# EAGLE design integrated_bldc_dev (EAGLE 6.6.0)
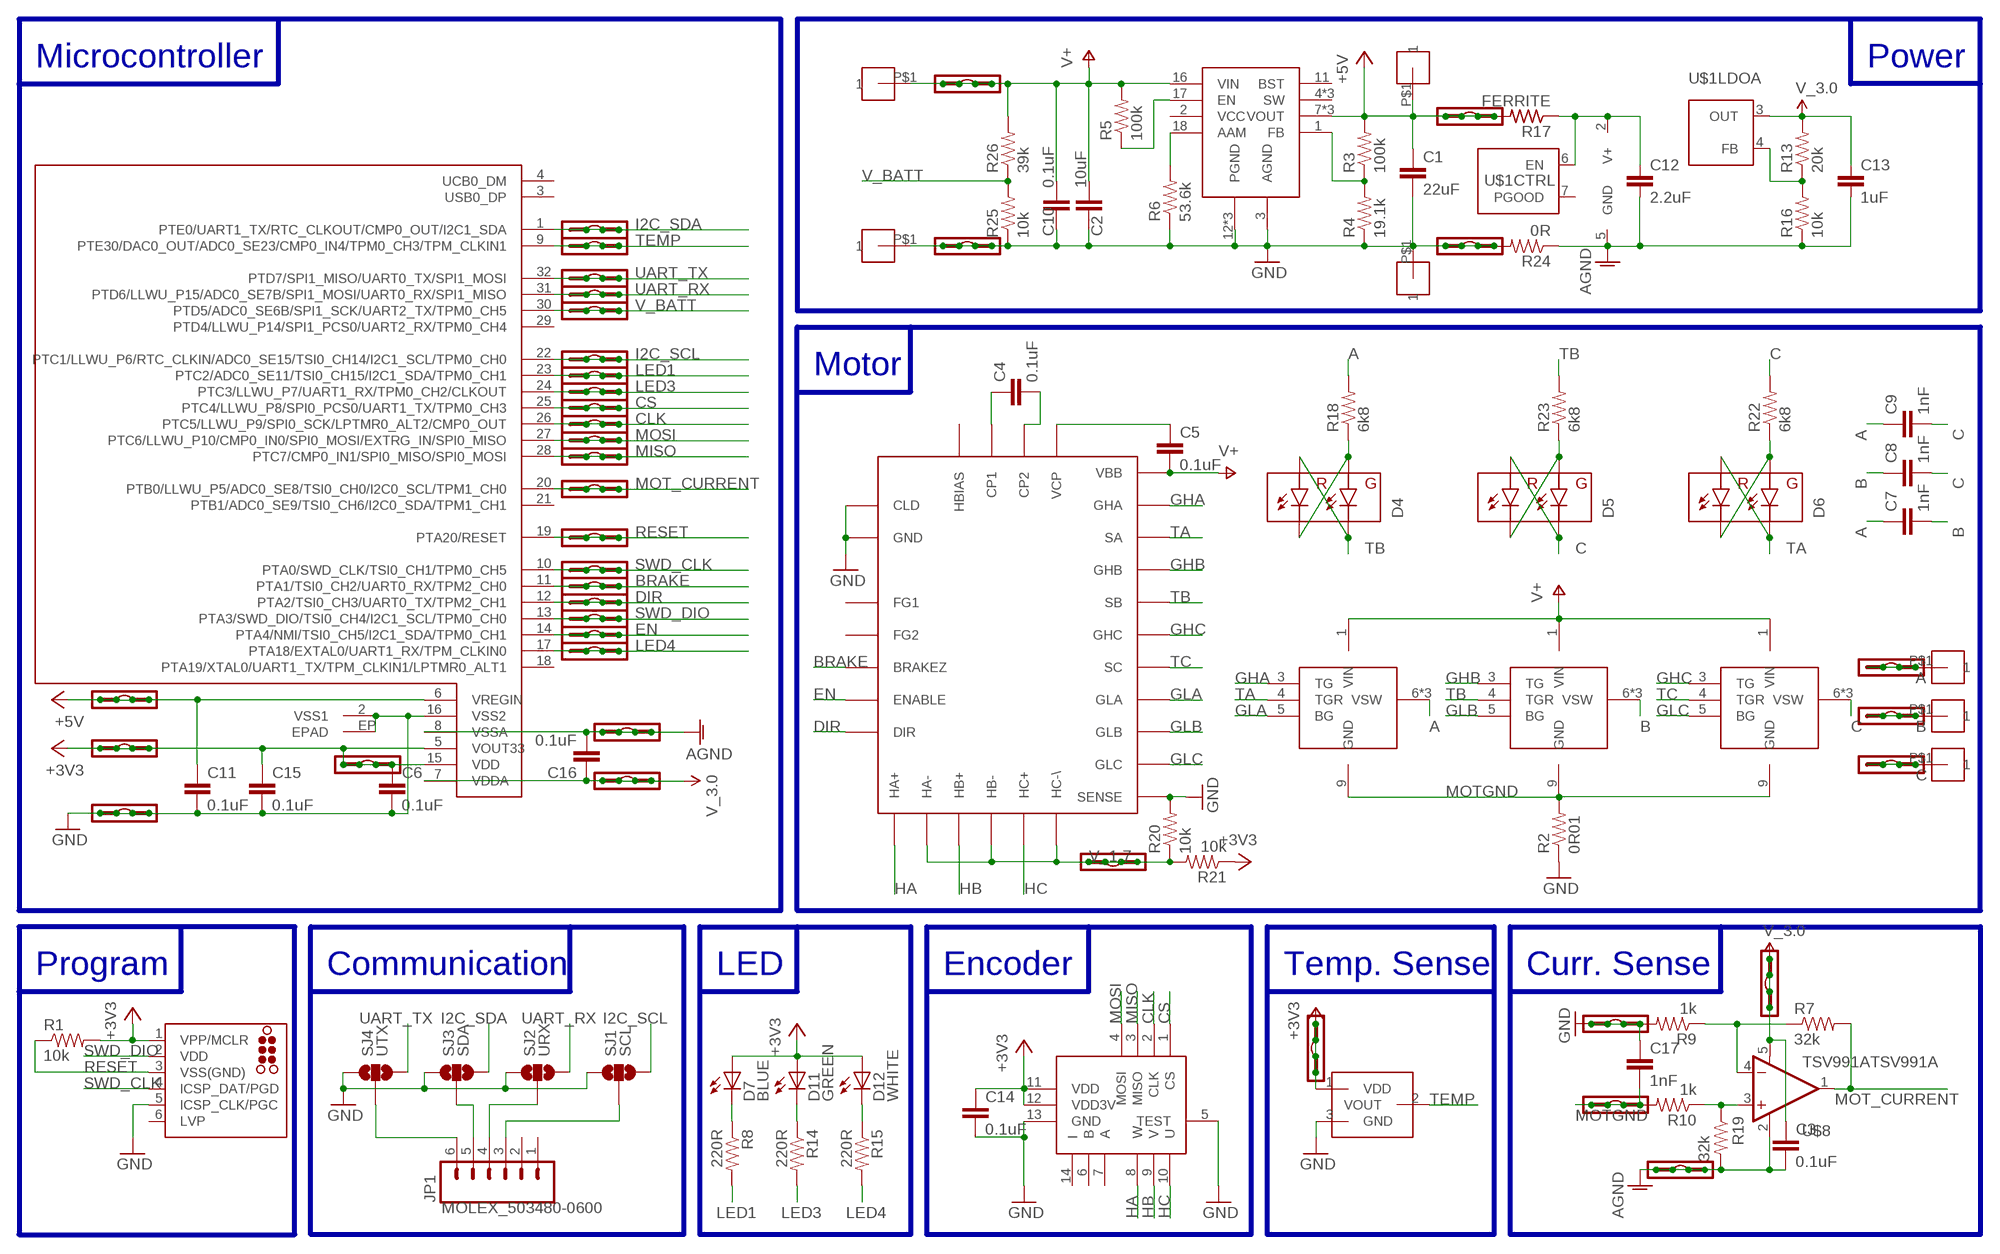
[diagram p0: schematic, sheet 1]

## Parts
3V3  M04LOCK  [1X04_LOCK]
A  M04LOCK  [1X04_LOCK]
AGND  M04LOCK  [1X04_LOCK]
AS5047P  AS5047P  [TSSOP14]
B  M04LOCK  [1X04_LOCK]
BRAKE  M04LOCK  [1X04_LOCK]
C  M04LOCK  [1X04_LOCK]
C1  22uF  CAP1210  [1210]
C2  10uF  CAP1206  [1206]
C3  0.1uF  CAP0402-CAP  [0402-CAP]
C4  0.1uF  CAP0402-CAP  [0402-CAP]
C5  0.1uF  CAP0402-CAP  [0402-CAP]
C6  0.1uF  CAP0402-CAP  [0402-CAP]
C7  1nF  CAP0603-CAP  [0603-CAP]
C8  1nF  CAP0603-CAP  [0603-CAP]
C9  1nF  CAP0603-CAP  [0603-CAP]
C10  0.1uF  CAP0603-CAP  [0603-CAP]
C11  0.1uF  CAP0402-CAP  [0402-CAP]
C12  2.2uF  CAP0402-CAP  [0402-CAP]
C13  1uF  CAP0402-CAP  [0402-CAP]
C14  0.1uF  CAP0402-CAP  [0402-CAP]
C15  0.1uF  CAP0402-CAP  [0402-CAP]
C16  0.1uF  CAP0402-CAP  [0402-CAP]
C17  1nF  CAP0402-CAP  [0402-CAP]
CLK  M04LOCK  [1X04_LOCK]
CS  M04LOCK  [1X04_LOCK]
D4  LED-RGLTST-C195KGJRKT  [LTST-C195KGJRKT]
D5  LED-RGLTST-C195KGJRKT  [LTST-C195KGJRKT]
D6  LED-RGLTST-C195KGJRKT  [LTST-C195KGJRKT]
D7  BLUE  LED-BLUE0603  [LED-0603]
D11  GREEN  LED-GREEN0603  [LED-0603]
D12  WHITE  LED-GREEN0603  [LED-0603]
DIR  M04LOCK  [1X04_LOCK]
EN  M04LOCK  [1X04_LOCK]
J2  PRG  TC2030-MCP-NL  [TC2030-MCP-NL]
JP1  MOLEX_503480-0600  [MOLEX_503480-0600]
LED1  M04LOCK  [1X04_LOCK]
LED3  M04LOCK  [1X04_LOCK]
LED4  M04LOCK  [1X04_LOCK]
MISO  M04LOCK  [1X04_LOCK]
MOSI  M04LOCK  [1X04_LOCK]
MOTCUR  M04LOCK  [1X04_LOCK]
MOTHI  M04LOCK  [1X04_LOCK]
MOTLO  M04LOCK  [1X04_LOCK]
PCLK  M04LOCK  [1X04_LOCK]
PDIO  M04LOCK  [1X04_LOCK]
R1  10k  RESISTOR0402-RES  [0402-RES]
R2  0R01  RESISTOR1206  [1206]
R3  100k  RESISTOR0402-RES  [0402-RES]
R4  19.1k  RESISTOR0402-RES  [0402-RES]
R5  100k  RESISTOR0402-RES  [0402-RES]
R6  53.6k  RESISTOR0402-RES  [0402-RES]
R7  32k  RESISTOR0402-RES  [0402-RES]
R8  220R  RESISTOR0402-RES  [0402-RES]
R9  1k  RESISTOR0402-RES  [0402-RES]
R10  1k  RESISTOR0402-RES  [0402-RES]
R13  20k  RESISTOR0402-RES  [0402-RES]
R14  220R  RESISTOR0402-RES  [0402-RES]
R15  220R  RESISTOR0402-RES  [0402-RES]
R16  10k  RESISTOR0402-RES  [0402-RES]
R17  FERRITE  R-US_R0603  [R0603]
R18  6k8  RESISTOR0402-RES  [0402-RES]
R19  32k  RESISTOR0402-RES  [0402-RES]
R20  10k  RESISTOR0402-RES  [0402-RES]
R21  10k  RESISTOR0402-RES  [0402-RES]
R22  6k8  RESISTOR0402-RES  [0402-RES]
R23  6k8  RESISTOR0402-RES  [0402-RES]
R24  0R  RESISTOR0402-RES  [0402-RES]
R25  10k  RESISTOR0402-RES  [0402-RES]
R26  39k  RESISTOR0402-RES  [0402-RES]
RESET  M04LOCK  [1X04_LOCK]
RX  M04LOCK  [1X04_LOCK]
SCL  M04LOCK  [1X04_LOCK]
SDA  M04LOCK  [1X04_LOCK]
SJ1  SCL  SOLDERJUMPER_2WAY  [SJ_TINY]
SJ2  URX  SOLDERJUMPER_2WAY  [SJ_TINY]
SJ3  SDA  SOLDERJUMPER_2WAY  [SJ_TINY]
SJ4  UTX  SOLDERJUMPER_2WAY  [SJ_TINY]
TEMP  M04LOCK  [1X04_LOCK]
TX  M04LOCK  [1X04_LOCK]
U$1  SC560C  [MLPQ-UT8]
U$2  A4931SMT  [28-CONTACT-QFN-ET]
U$3  MKL25Z128VFM4  [QFN-32]
U$4  MOSFET-HALFBRIDGECSD87333Q3D  [SON8]
U$5  MOSFET-HALFBRIDGECSD87333Q3D  [SON8]
U$6  MOSFET-HALFBRIDGECSD87333Q3D  [SON8]
U$7  MPM3610MPM3610GQV  [QFN20]
U$8  TSV991ATSV991A  [SOT23-5]
U$9  SOT_TEMP_SENSE  [SOT23-3]
U$10  A  PADMOT  [SMD_MOT_PAD]
U$11  B  PADMOT  [SMD_MOT_PAD]
U$12  C  PADMOT  [SMD_MOT_PAD]
V1.7  M04LOCK  [1X04_LOCK]
V3.0  M04LOCK  [1X04_LOCK]
V+  M04LOCK  [1X04_LOCK]
V-  M04LOCK  [1X04_LOCK]
V_BATT  M04LOCK  [1X04_LOCK]
VA+  M04LOCK  [1X04_LOCK]
VA-  M04LOCK  [1X04_LOCK]
VDD  M04LOCK  [1X04_LOCK]
VDDA  M04LOCK  [1X04_LOCK]
VIN+  V+  PAD  [SMD_BAT_PAD]
VIN-  GND  PAD  [SMD_BAT_PAD]
VOUT33  M04LOCK  [1X04_LOCK]
VOUT+  A  PADMOT  [SMD_MOT_PAD]
VOUT-  A  PADMOT  [SMD_MOT_PAD]
VREGIN  M04LOCK  [1X04_LOCK]
VSS  M04LOCK  [1X04_LOCK]
VSSA  M04LOCK  [1X04_LOCK]

## Nets
+3V3: 3V3.1 3V3.2 3V3.3 3V3.4 AS5047P.11(VDD) AS5047P.12(VDD3V) C6.1 C14.1 C15.1 D7.A D11.A D12.A J2.1(VPP/MCLR) R1.2 R21.1 U$3.5(VOUT33) U$3.15(VDD) U$9.1(VDD) VDD.1 VDD.2 VDD.3 VDD.4 VOUT33.1 VOUT33.2 VOUT33.3 VOUT33.4
+5V: C1.1 C11.1 R3.2 R17.2 U$3.6(VREGIN) U$7.7(VOUT) U$7.8(VOUT) U$7.9(VOUT) VA+.1 VA+.2 VA+.3 VA+.4 VOUT+.P$1 VREGIN.1 VREGIN.2 VREGIN.3 VREGIN.4
A: A.1 A.2 A.3 A.4 C7.1 C9.1 R18.2 U$5.6(VSW) U$5.7(VSW) U$5.8(VSW) U$10.P$1
AGND: AGND.1 AGND.2 AGND.3 AGND.4 C3.2 C12.2 C13.2 C16.2 R16.1 R19.2 R24.1 U$1.5(GND) U$3.8(VSSA) U$8.2(V-) VSSA.1 VSSA.2 VSSA.3 VSSA.4
B: B.1 B.2 B.3 B.4 C7.2 C8.1 U$4.6(VSW) U$4.7(VSW) U$4.8(VSW) U$11.P$1
BEN: R5.1 U$7.17(EN)
BRAKE: BRAKE.1 BRAKE.2 BRAKE.3 BRAKE.4 U$2.28(BRAKEZ) U$3.11(PTA1/TSI0_CH2/UART0_RX/TPM2_CH0)
C: C8.2 C9.2 C.1 C.2 C.3 C.4 D5.P$2(RA) D5.P$3(GC) R22.2 U$6.6(VSW) U$6.7(VSW) U$6.8(VSW) U$12.P$1
CLK: AS5047P.2(CLK) CLK.1 CLK.2 CLK.3 CLK.4 U$3.26(PTC5/LLWU_P9/SPI0_SCK/LPTMR0_ALT2/CMP0_OUT)
CS: AS5047P.1(CS) CS.1 CS.2 CS.3 CS.4 U$3.25(PTC4/LLWU_P8/SPI0_PCS0/UART1_TX/TPM0_CH3)
DIR: DIR.1 DIR.2 DIR.3 DIR.4 U$2.26(DIR) U$3.12(PTA2/TSI0_CH3/UART0_TX/TPM2_CH1)
EN: EN.1 EN.2 EN.3 EN.4 U$2.27(ENABLE) U$3.14(PTA4/NMI/TSI0_CH5/I2C1_SDA/TPM0_CH1)
FB: R3.1 R4.2 U$7.1(FB)
GHA: U$2.21(GHA) U$5.3(TG)
GHB: U$2.19(GHB) U$4.3(TG)
GHC: U$2.17(GHC) U$6.3(TG)
GLA: U$2.16(GLA) U$5.5(BG)
GLB: U$2.15(GLB) U$4.5(BG)
GLC: U$2.14(GLC) U$6.5(BG)
GND: AS5047P.5(TEST) AS5047P.13(GND) C1.2 C2.2 C6.2 C10.2 C11.2 C14.2 C15.2 C17.1 J2.5(ICSP_CLK/PGC) MOTLO.1 MOTLO.2 MOTLO.3 MOTLO.4 R2.1 R4.1 R6.1 R9.2 R20.2 R24.2 R25.1 SJ1.1 SJ2.1 SJ3.1 SJ4.1 U$2.7(GND) U$2.13(SENSE) U$2.25(CLD) U$3.2(VSS1) U$3.16(VSS2) U$3.EP(EPAD) U$7.3(AGND) U$7.12(PGND) U$7.13(PGND) U$7.14(PGND) U$9.3(GND) V-.1 V-.2 V-.3 V-.4 VA-.1 VA-.2 VA-.3 VA-.4 VIN-.P$1 VOUT-.P$1 VSS.1 VSS.2 VSS.3 VSS.4
HA: AS5047P.8(W) U$2.1(HA+)
HB: AS5047P.9(V) U$2.3(HB+)
HC: AS5047P.10(U) U$2.5(HC+)
I2C_SCL: SCL.1 SCL.2 SCL.3 SCL.4 SJ1.3 U$3.22(PTC1/LLWU_P6/RTC_CLKIN/ADC0_SE15/TSI0_CH14/I2C1_SCL/TPM0_CH0)
I2C_SDA: SDA.1 SDA.2 SDA.3 SDA.4 SJ3.3 U$3.1(PTE0/UART1_TX/RTC_CLKOUT/CMP0_OUT/I2C1_SDA)
LED1: LED1.1 LED1.2 LED1.3 LED1.4 R8.2 U$3.23(PTC2/ADC0_SE11/TSI0_CH15/I2C1_SDA/TPM0_CH1)
LED3: LED3.1 LED3.2 LED3.3 LED3.4 R14.2 U$3.24(PTC3/LLWU_P7/UART1_RX/TPM0_CH2/CLKOUT)
LED4: LED4.1 LED4.2 LED4.3 LED4.4 R15.2 U$3.17(PTA18/EXTAL0/UART1_RX/TPM_CLKIN0)
MISO: AS5047P.3(MISO) MISO.1 MISO.2 MISO.3 MISO.4 U$3.28(PTC7/CMP0_IN1/SPI0_MISO/SPI0_MOSI)
MOSI: AS5047P.4(MOSI) MOSI.1 MOSI.2 MOSI.3 MOSI.4 U$3.27(PTC6/LLWU_P10/CMP0_IN0/SPI0_MOSI/EXTRG_IN/SPI0_MISO)
MOT_CURRENT: MOTCUR.1 MOTCUR.2 MOTCUR.3 MOTCUR.4 R7.2 U$3.20(PTB0/LLWU_P5/ADC0_SE8/TSI0_CH0/I2C0_SCL/TPM1_CH0) U$8.1(OUT)
MOTGND: C17.2 MOTHI.1 MOTHI.2 MOTHI.3 MOTHI.4 R2.2 R10.2 U$4.9(GND) U$5.9(GND) U$6.9(GND)
N$1: R7.1 R9.1 U$8.4(-IN)
N$2: R10.1 R19.1 U$8.3(+IN)
N$3: D4.P$1(GA) D4.P$4(RC) R18.1
N$4: D7.C R8.1
N$5: R6.2 U$7.18(AAM)
N$10: D11.C R14.1
N$12: D12.C R15.1
N$13: R13.1 R16.2 U$1.4(LDOA:FB)
N$14: D5.P$1(GA) D5.P$4(RC) R23.1
N$15: C12.1 R17.1 U$1.2(V+) U$1.6(CTRL:EN)
N$16: D6.P$1(GA) D6.P$4(RC) R22.1
N$19: C5.1 U$2.12(VCP)
N$20: C4.1 U$2.9(CP1)
N$21: C4.2 U$2.10(CP2)
N$36: JP1.6 SJ4.2
N$37: JP1.5 SJ3.2
N$38: JP1.4 SJ2.2
N$39: JP1.3 SJ1.2
RESET: J2.3(VSS(GND)) R1.1 RESET.1 RESET.2 RESET.3 RESET.4 U$3.19(PTA20/RESET)
SWD_CLK: J2.4(ICSP_DAT/PGD) PCLK.1 PCLK.2 PCLK.3 PCLK.4 U$3.10(PTA0/SWD_CLK/TSI0_CH1/TPM0_CH5)
SWD_DIO: J2.2(VDD) PDIO.1 PDIO.2 PDIO.3 PDIO.4 U$3.13(PTA3/SWD_DIO/TSI0_CH4/I2C1_SCL/TPM0_CH0)
TA: D6.P$2(RA) D6.P$3(GC) U$2.22(SA) U$5.4(TGR)
TB: D4.P$2(RA) D4.P$3(GC) R23.2 U$2.20(SB) U$4.4(TGR)
TC: U$2.18(SC) U$6.4(TGR)
TEMP: TEMP.1 TEMP.2 TEMP.3 TEMP.4 U$3.9(PTE30/DAC0_OUT/ADC0_SE23/CMP0_IN4/TPM0_CH3/TPM_CLKIN1) U$9.2(VOUT)
UART_RX: RX.1 RX.2 RX.3 RX.4 SJ2.3 U$3.31(PTD6/LLWU_P15/ADC0_SE7B/SPI1_MOSI/UART0_RX/SPI1_MISO)
UART_TX: SJ4.3 TX.1 TX.2 TX.3 TX.4 U$3.32(PTD7/SPI1_MISO/UART0_TX/SPI1_MOSI)
V+: C2.1 C5.2 C10.1 R5.2 R26.2 U$2.11(VBB) U$4.1(VIN) U$5.1(VIN) U$6.1(VIN) U$7.16(VIN) V+.1 V+.2 V+.3 V+.4 VIN+.P$1
V_1.7: R20.1 R21.2 U$2.2(HA-) U$2.4(HB-) U$2.6(HC-\) V1.7.1 V1.7.2 V1.7.3 V1.7.4
V_3.0: C3.1 C13.1 C16.1 R13.2 U$1.3(LDOA:OUT) U$3.7(VDDA) U$8.5(V+) V3.0.1 V3.0.2 V3.0.3 V3.0.4 VDDA.1 VDDA.2 VDDA.3 VDDA.4
V_BATT: R25.2 R26.1 U$3.30(PTD5/ADC0_SE6B/SPI1_SCK/UART2_TX/TPM0_CH5) V_BATT.1 V_BATT.2 V_BATT.3 V_BATT.4
Unconnected: AS5047P.6(B) AS5047P.7(A) AS5047P.14(I) J2.6(LVP) JP1.1 JP1.2 U$1.1(LDOB:OUT) U$1.7(CTRL:PGOOD) U$1.8(LDOB:FB) U$2.8(HBIAS) U$2.23(FG1) U$2.24(FG2) U$3.3(USB0_DP) U$3.4(UCB0_DM) U$3.18(PTA19/XTAL0/UART1_TX/TPM_CLKIN1/LPTMR0_ALT1) U$3.21(PTB1/ADC0_SE9/TSI0_CH6/I2C0_SDA/TPM1_CH1) U$3.29(PTD4/LLWU_P14/SPI1_PCS0/UART2_RX/TPM0_CH4) U$7.2(VCC) U$7.4(SW) U$7.5(SW) U$7.6(SW) U$7.11(BST)

## Buses
B$1
B$2
B$3
B$4
B$5
B$6
B$7
B$8
B$9

## Notes on the sheet
- Microcontroller | Power
- Motor
- Program | Communication | LED | Encoder | Temp. Sense | Curr. Sense

## Library data of the parts
3V3 A AGND B BRAKE C CLK CS DIR EN LED1 LED3 LED4 MISO MOSI MOTCUR MOTHI MOTLO PCLK PDIO RESET RX SCL SDA TEMP TX V1.7 V3.0 V+ V- V_BATT VA+ VA- VDD VDDA VOUT33 VREGIN VSS VSSA = modular_robotics:M04: Header 4 Standard 4-pin 0.1" header. Use with straight break away headers (SKU : PRT-00116), right angle break away headers (PRT-00553), swiss pins (PRT-00743), machine pins (PRT-00117), and female headers (PRT-00115). Molex polarized connector foot print use with SKU : PRT-08231 with associated crimp pins and housings. 1MM SMD Version SKU: PRT-10208
AS5047P = dhaldane:AS5047P
C1-C11 C14-C17 = SparkFun-Passives:CAP: Capacitor Standard 0603 ceramic capacitor, and 0.1" leaded capacitor.
C12 = biomimetic:CAP: Capacitor Standard 0603 ceramic capacitor, and 0.1" leaded capacitor.; VOLTAGE: 10V
C13 = biomimetic:CAP: Capacitor Standard 0603 ceramic capacitor, and 0.1" leaded capacitor.; VOLTAGE: 6.3V
D4-D6 = SparkFun-LED:LED-RG; PROD_ID: DIO-12140
D7 = SparkFun-LED:LED-BLUE: Blue LEDs for production use Various blue LEDs stocked by SparkFun production 0603 - DIO-08575 Rebel - DIO-09553 1206 - DIO-09911; PROD_ID: DIO-08575
D11 = SparkFun-LED:LED-GREEN: Various green LEDs 0603- DIO-00821 LARGE- DIO-00862 LILYPAD- DIO-09910; PROD_ID: DIO-00821
D12 = SparkFun-LED:LED-GREEN: Various green LEDs 0603- DIO-00821 LARGE- DIO-00862 LILYPAD- DIO-09910; PROD_ID: DIO-00821; VALUE: GREEN
J2 = tag-connect:TC2030: TAG-CONNECT ICSP Connector Manufacturer: Tag-Connect <http://www.tag-connect.com> Cable for easy In-Circuit Serial Programming. Designed for Microchip ICD2, suitable for many others. Two variants - one "with legs" (for hands-free fit on PCB) and another "without legs" for quick programming. PAD Description 1 MCLR/Vpp 2 Vdd 3 GND 4 PGD (ISPDAT) 5 PGC (ISPCLK) 6 nc (used for LVP) ©2009 ROFA.cz - modified and updated by Robert Darlington ‹rdarlington@gmail.com›
JP1 = biomimetic:MOLEX_503480-0600: Molex FPC connector, 6 pos.; DIGIKEY: WM1387CT-ND
R1-R10 R14 R15 R18-R24 = SparkFun-Passives:RESISTOR: Resistor Basic schematic elements and footprints for 0603, 1206, and PTH resistors.
R13 R16 R25 R26 = biomimetic:RESISTOR: Resistor Basic schematic elements and footprints for 0603, 1206, and PTH resistors.
R17 = rcl:R-US_: RESISTOR, American symbol
SJ1-SJ4 = modular_robotics:SOLDERJUMPER_2WAY: Solder Jumper 2 way solder jumper
U$1 = modular_robotics:SC560C
U$2 = ee192:A4931
U$3 = dhaldane:MKL25Z128VFM4
U$4-U$6 = dhaldane:MOSFET-HALFBRIDGE
U$7 = dhaldane:MPM3610
U$8 = dhaldane:TSV991A
U$9 = dhaldane:SOT_TEMP_SENSE
U$10-U$12 VIN+ VIN- VOUT+ VOUT- = dhaldane:PAD

## Board
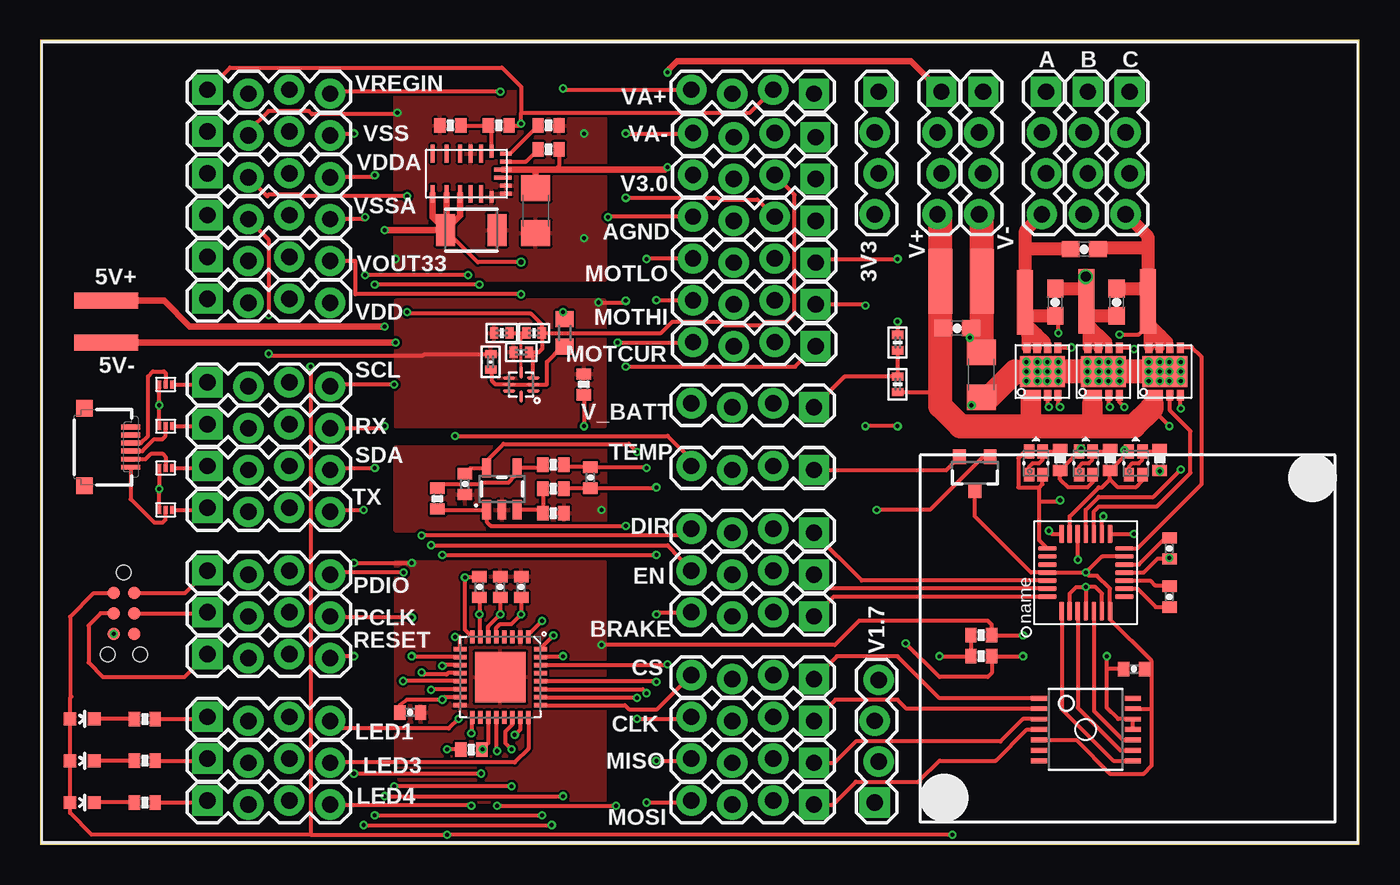
[diagram p1: board, top side]
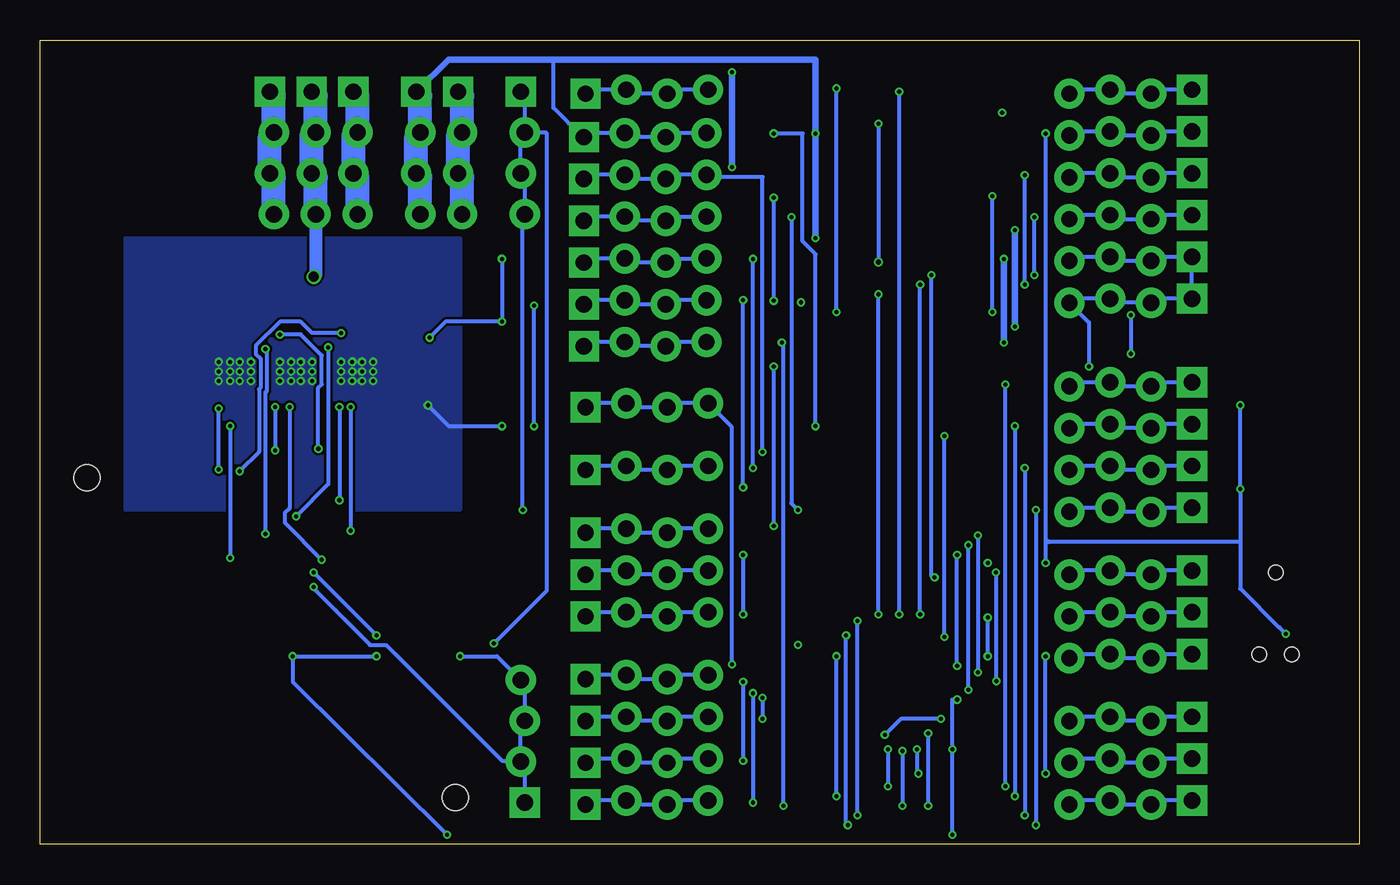
[diagram p2: board, bottom side, seen from below]

Size 82 x 50 mm. Coordinates in mm from the lower left corner, seen from the top.
Outline: 0,0 82,0 82,50 0,50 0,0
Copper layers (1*16): Top 0.035mm / dielectric 1.5mm / Bottom 0.035mm
Design rules "bay_area_circuits": minimum track width 5mil, minimum drill 10mil, track to track 5mil, track to pad 5mil, pad to pad 5mil, via to via 5mil, smd to smd 5mil, copper to edge 10mil, drill to drill 10mil, minimum pad ring 5mil, minimum via ring 5mil, stop-mask expansion 4mil, vias tented up to drill 5mil, thermal gap 6mil
Holes 1.6 mm at 56.2,2.9 79.1,22.8

### Footprints (pad centres in the part's own frame; a part is rotated, then mirrored left to right if it is on the bottom)
1X04_LOCK = drill 1.016 pad 1.88 square: 1 0,0.127 | drill 1.016 pad 1.88: 2 2.54,-0.127; 3 5.08,0.127; 4 7.62,-0.127
TSSOP14 = smd 0.991 x 0.305: 1 -2.918,4.49; 2 -2.918,3.84; 3 -2.918,3.19; 4 -2.918,2.54; 5 -2.918,1.89; 6 -2.918,1.24; 7 -2.918,0.59; 8 2.918,0.59; 9 2.918,1.24; 10 2.918,1.89; 11 2.918,2.54; 12 2.918,3.19; 13 2.918,3.84; 14 2.918,4.49
1210 = smd 1.2 x 2: 1 -1.6,0; 2 1.6,0
1206 = smd 1.6 x 1.8: 1 -1.4,0; 2 1.4,0
0402-CAP = smd 0.7 x 0.9: 1 -0.65,0; 2 0.65,0
0603-CAP = smd 1.1 x 1: 1 -0.85,0; 2 0.85,0
0402-CAP' = smd 0.508 x 0.711: 1 -0.483,0; 2 0.483,0
LTST-C195KGJRKT = smd 0.65 x 0.85: P$1 0.425,0.725; P$2 -0.425,0.725; P$3 0.425,-0.725; P$4 -0.425,-0.725
LED-0603 = smd 0.8 x 0.8: A 0,-0.75; C 0,0.75
TC2030-MCP-NL = smd 0.787 x 0.787: 1 1.27,-0.635; 2 1.27,0.635; 3 2.54,-0.635; 4 2.54,0.635; 5 3.81,-0.635; 6 3.81,0.635 | hole 0.889: 0,0; 5.08,-1.016; 5.08,1.016
MOLEX_503480-0600 = smd 0.3 x 1.15: 1 -1.25,1.725; 2 -0.75,1.725; 3 -0.25,1.725; 4 0.25,1.725; 5 0.75,1.725; 6 1.25,1.725 | smd 1.035 x 1: L -2.408,-1.15; R 2.408,-1.15
0402-RES = smd 0.7 x 0.9: 1 -0.65,0; 2 0.65,0
0402-RES' = smd 0.508 x 0.711: 1 -0.483,0; 2 0.483,0
R0603 = smd 1 x 1.1: 1 -0.85,0; 2 0.85,0
SJ_TINY = smd 0.5 x 0.25: 1 0,0.4; 2 0,0; 3 0,-0.4
MLPQ-UT8 = smd 0.8 x 0.2: 1 -0.75,0.4; 2 -0.75,0; 3 -0.75,-0.4; 5 0.75,-0.4; 6 0.75,0; 7 0.75,0.4 | smd 0.2 x 0.8: 4 0,-0.75; 8 0,0.75
28-CONTACT-QFN-ET = smd 1.15 x 0.3: 1 -2.4,1.5; 2 -2.4,1; 3 -2.4,0.5; 4 -2.4,0; 5 -2.4,-0.5; 6 -2.4,-1; 7 -2.4,-1.5; 15 2.4,-1.5; 16 2.4,-1; 17 2.4,-0.5; 18 2.4,0; 19 2.4,0.5; 20 2.4,1; 21 2.4,1.5 | smd 0.3 x 1.15: 8 -1.5,-2.4; 9 -1,-2.4; 10 -0.5,-2.4; 11 0,-2.4; 12 0.5,-2.4; 13 1,-2.4; 14 1.5,-2.4; 22 1.5,2.4; 23 1,2.4; 24 0.5,2.4; 25 0,2.4; 26 -0.5,2.4; 27 -1,2.4; 28 -1.5,2.4
QFN-32 = smd 0.285 x 0.8: 1 -1.75,-2.5; 2 -1.25,-2.5; 3 -0.75,-2.5; 4 -0.25,-2.5; 5 0.25,-2.5; 6 0.75,-2.5; 7 1.25,-2.5; 8 1.75,-2.5; 17 1.75,2.5; 18 1.25,2.5; 19 0.75,2.5; 20 0.25,2.5; 21 -0.25,2.5; 22 -0.75,2.5; 23 -1.25,2.5; 24 -1.75,2.5 | smd 0.8 x 0.285: 9 2.5,-1.75; 10 2.5,-1.25; 11 2.5,-0.75; 12 2.5,-0.25; 13 2.5,0.25; 14 2.5,0.75; 15 2.5,1.25; 16 2.5,1.75; 25 -2.5,1.75; 26 -2.5,1.25; 27 -2.5,0.75; 28 -2.5,0.25; 29 -2.5,-0.25; 30 -2.5,-0.75; 31 -2.5,-1.25; 32 -2.5,-1.75 | smd 3.15 x 3.15: EP 0,0
SON8 = smd 0.65 x 1.09: 1 1.475,-0.65 | smd 0.65 x 0.44: 3 1.475,0.325; 4 1.475,0.975; 5 -1.475,0.975; 6 -1.475,0.325; 7 -1.475,-0.325; 8 -1.475,-0.975 | smd 1.9 x 2.8: 9 0,0
QFN20 = smd 0.8 x 0.25: 1 -1.4,1.55 | smd 1.1 x 0.25: 2 -1.25,0.9; 3 -1.25,0.25; 4 -1.25,-0.4; 5 -1.25,-1.25; 6 -1.25,-2.1; 7 1.25,-2.1; 8 1.25,-1.25; 9 1.25,-0.4; 10 1.25,0.25; 11 1.25,0.9 | smd 0.7 x 0.25: 12 1.45,1.55 | smd 0.25 x 0.7: 13 1.25,2.45; 14 0.75,2.45; 17 -0.75,2.45; 18 -1.25,2.45 | smd 0.25 x 1.1: 15 0.25,2.25; 16 -0.25,2.25
SOT23-5 = smd 0.55 x 1.2: 1 -0.95,-1.3; 2 0,-1.3; 3 0.95,-1.3; 4 0.95,1.3; 5 -0.95,1.3
SOT23-3 = smd 0.8 x 0.9: 1 -0.95,-1; 2 0.95,-1; 3 0,1.1
SMD_MOT_PAD = smd 4 x 1: P$1 0.2,0
SMD_BAT_PAD = smd 4 x 1.5: P$1 0.1,0.05

### Placement (x,y rotation side)
3V3  52,46.8 270 top
A  62.4,46.8 270 top
AGND  48.2,38.9 180 top
AS5047P  65,4.6 0 top
B  65,46.8 270 top
BRAKE  48.1,14.3 180 top
C  67.6,46.8 270 top
C1  26.8,38.2 0 top
C2  30.8,39.4 270 top
C3  26.4,22.4 270 top
C4  70.2,15.4 90 top
C5  70.2,18.4 270 top
C6  23,8.2 0 top
C7  63.11,33.71 90 top
C8  66.92,33.71 90 top
C9  64.9,37 0 top
C10  57,32.1 0 top
C11  28.6,16 90 top
C12  2.2uF  [0402-CAP']  28,30 90 top
C13  1uF  [0402-CAP']  29.9,30.6 180 top
C14  68,10.9 0 top
C15  29.9,16 90 top
C16  27.3,16 90 top
C17  34.2,22.8 270 top
CLK  48.1,7.8 180 top
CS  48.1,10.4 180 top
D4  68.1,23.7 180 top
D5  65,23.7 180 top
D6  61.9,23.7 180 top
D7  2.6,7.8 270 top
D11  2.6,5.2 270 top
D12  2.6,2.6 270 top
DIR  48.1,19.5 180 top
EN  48.1,16.9 180 top
J2  5.2,16.9 270 top
JP1  3.9,24.7 270 top
LED1  10.4,7.8 0 top
LED3  10.4,5.2 0 top
LED4  10.4,2.6 0 top
MISO  48.1,5.2 180 top
MOSI  48.1,2.6 180 top
MOTCUR  48.2,31.1 180 top
MOTHI  48.2,33.7 180 top
MOTLO  48.2,36.3 180 top
PCLK  10.4,14.3 0 top
PDIO  10.4,16.9 0 top
R1  26.8,5.9 180 top
R2  58.5,29.2 270 top
R3  28.5,44.7 0 top
R4  25.5,44.7 0 top
R5  31.6,43.2 0 top
R6  31.6,44.7 180 top
R7  24.7,21.5 270 top
R8  6.5,7.8 0 top
R9  31.9,23.6 0 top
R10  31.9,22.1 0 top
R13  20k  [0402-RES']  30.7,31.8 0 top
R14  6.5,5.2 0 top
R15  6.5,2.6 0 top
R16  10k  [0402-RES']  28.7,31.8 0 top
R17  32.6,31.8 90 top
R18  69.6,23.9 270 top
R19  31.9,20.6 0 top
R20  58.5,13 0 top
R21  58.5,11.7 180 top
R22  63.4,23.9 270 top
R23  66.5,23.9 270 top
R24  33.8,28.6 270 top
R25  10k  [0402-RES']  53.3,31.2 270 top
R26  39k  [0402-RES']  53.3,28.6 270 top
RESET  10.4,11.7 0 top
RX  10.4,26 0 top
SCL  10.4,28.6 0 top
SDA  10.4,23.4 0 top
SJ1  7.8,28.6 90 top
SJ2  7.8,26 90 top
SJ3  7.8,23.4 90 top
SJ4  7.8,20.8 90 top
TEMP  48.1,23.4 180 top
TX  10.4,20.8 0 top
U$1  29.9,28.6 180 top
U$2  65,16.9 90 top
U$3  28.6,10.4 180 top
U$4  66.1,29.4 270 top
U$5  62.3,29.4 270 top
U$6  69.9,29.4 270 top
U$7  26.5,41.7 270 top
U$8  28.7,22.1 0 top
U$9  58.1,23.1 180 top
U$10  61.22,33.5 90 top
U$11  65.04,33.56 90 top
U$12  68.85,33.56 90 top
U$16  [INFO]  79.3,27.3 90 top
V1.7  52,2.6 90 top
V3.0  48.2,41.5 180 top
V+  55.9,46.8 270 top
V-  58.5,46.8 270 top
V_BATT  48.1,27.3 180 top
VA+  48.1,46.8 180 top
VA-  48.2,44.1 180 top
VDD  10.4,33.8 0 top
VDDA  10.4,41.6 0 top
VIN+  55.9,35.1 270 top
VIN-  58.5,35.1 270 top
VOUT33  10.4,36.4 0 top
VOUT+  3.9,33.8 0 top
VOUT-  3.9,31.2 0 top
VREGIN  10.4,46.8 0 top
VSS  10.4,44.2 0 top
VSSA  10.4,39 0 top

### Tracks (layer width: path | path; a pad name or v marks a point on that pad's centre or on a via)
+3V3  (via drill 0.25)
  Top 0.254: U$3.5 28.35,13.45 28.6,13.7 29.3,13.7 v29.9,14.3 C15.1 | J2.1 3.33,15.63 1.85,14.15 1.85,9.1 | R1.2 v25.3,5.9 | U$3.15 25.15,9.15 v25,9 22.8,9 22.35,8.65 C6.1 | 1.85,9.1 D7.A D11.A D12.A 1.85,1.95 3.2,0.6 16.8,0.6 | 1.85,9.1 1.95,9.2 | AS5047P.11 AS5047P.12 67.01,7.79 66.3,8.5 66.3,11 | 66.3,11 v66.3,11.7 | v56.7,0.6 v25.3,0.6 16.8,0.6 | U$9.1 58.6,24.1 55.3,20.8 v52,20.8 | v53.8,12.5 55.9,10.4 58.9,10.4 59.15,10.65 R21.1 v61.1,11.7 | v16.8,29.7 16.8,0.6 | v29.9,34.2 19.59,34.2 19.59,36.27 VOUT33.4 | C14.1 66.4,10.9 66.3,11
  Bottom 0.254: 12.69,33.93 VDD.2 | VDD.2 15.23,33.67 VDD.3 17.77,33.93 VDD.4 16.8,32.45 v16.8,29.7 | VOUT33.4 17.77,36.53 VOUT33.3 15.23,36.27 VOUT33.2 12.69,36.53 VOUT33.1 VDD.1 12.69,33.93 | 3V3.2 52.13,44.01 3V3.3 51.87,41.47 3V3.4 52,39.05 v52,20.8 | 3V3.2 51.87,46.55 3V3.1 | v56.7,0.6 66.3,10.1 v66.3,11.7 v61.1,11.7 | v25.3,0.6 v25.3,5.9 25.3,9 v25,9 | v53.8,12.5 50.5,15.8 50.5,44.2 50.56,44.26 3V3.2 | 12.69,33.93 arc-90 VDD.2 | v29.9,14.3 v29.9,34.2
+5V  (via drill 0.25, 0.3)
  Top 0.254: U$3.6 27.85,13.55 v28.6,14.3 C11.1 | v28.6,46.8 18.15,46.8 VREGIN.4 | R3.2 29.8,44.7 v29.9,44.8 29.9,45.5 | v29.9,36.2 27.2,36.2 C1.1 | 29.9,45.5 44.13,45.5 VA+.2 | v32.5,47 32.57,46.93 VA+.4 | R17.2 32.5,32.75 v32.5,33.1 | VREGIN.1 10.43,46.93 11.8,48.3 28.7,48.3 29.9,47.1 29.9,45.5
  Top 0.406: U$7.9 26.1,39.1 C1.1 | U$7.7 24.4,39 C1.1 | U$7.8 25.25,38.25 C1.1 | VOUT+.P$1 7.7,33.8 9.3,32.2 v21.4,32.2 | C1.1 v21.4,38.2
  Bottom 0.254: VA+.4 42.77,46.93 VA+.3 45.31,46.67 VA+.2 47.85,46.93 VA+.1 | VREGIN.4 17.77,46.93 VREGIN.3 15.23,46.67 VREGIN.2 12.69,46.93 VREGIN.1 | v29.9,44.8 v29.9,36.2 | v28.6,14.3 v28.6,46.8 | v32.5,33.1 v32.5,47
  Bottom 0.406: v21.4,32.2 v21.4,38.2
A  (via drill 0.25)
  Top 0.254: 61.22,33.56 U$10.P$1 | v63.3,31.8 63.3,32.67 C7.1 | R18.2 v69.6,23.2
  Top 0.406: 62.51,31.29 arc-90 62.61,31.19 U$5.6
  Top 0.61: 62.51,31.29 62,31.8 61.9,31.6 61.96,31.54 U$5.7 | U$5.8 61.31,32.19 61.25,32.25
  Top 0.813: U$10.P$1 61.26,33.8 61.26,37 | C7.1 61.49,32.86 61.22,32.6 | 61.26,37 61.26,38.16 A.4 | C9.1 61.26,37
  Top 1.016: 61.22,33.56 61.22,32.6 61.22,32.28 61.25,32.25 61.9,31.6
  Bottom 0.254: v63.3,31.8 65.1,31.8 65.8,32.5 67.1,32.5 68.6,31 68.6,30.5 68.3,30.2 68.3,28.4 68.4,28.3 68.4,24.4 v69.6,23.2
  Bottom 1.5: A.4 62.27,41.47 A.3 62.53,44.01 A.2 62.27,46.55 A.1
AGND  (via drill 0.25)
  Top 0.254: v34.7,33.7 36.3,33.7 v36.4,33.8 | AGND.2 44.59,40.1 42.2,40.1 42.1,40.2 v36.4,40.2 | U$3.8 26.4,13.35 v26.4,16.6 27.25,16.6 C16.2 | v26.6,35.4 v20.2,35.4 | v20.2,39 20.07,38.87 VSSA.4 | AGND.4 35.33,39.03 v35.3,39 | VSSA.2 14.2,37.61 v14.2,32.9 | v14.2,30.5 14.3,30.4 23.8,30.4 23.88,30.48 C12.2
  Bottom 0.254: AGND.1 47.95,39.03 AGND.2 45.41,38.77 AGND.3 42.87,39.03 AGND.4 | VSSA.1 12.69,39.13 VSSA.2 15.23,38.87 VSSA.3 17.77,39.13 VSSA.4 | v36.4,33.8 v36.4,40.2 | v26.4,16.6 26.6,16.7 v26.6,35.4 | v20.2,35.4 v20.2,39 | v35.3,39 35.3,21.2 v34.9,20.8 | v14.2,32.9 v14.2,30.5
  pour Top (isolate 0.15, rank 2): 22.1,24.7 35.1,24.7 35.1,19.5 22.1,19.5
  pour Top (isolate 0.15): 35.1,33.8 22.1,33.8 22.1,26 35.1,26
B  (via drill 0.6)
  Top 0.254: 65.1,33.82 65.1,34.4 64.94,34.56 64.94,35.24 v65,35.3
  Top 0.406: 66.32,31.28 66.42,31.18 U$4.6
  Top 0.61: 66.32,31.28 65.9,31.7 65.8,31.7 65.7,31.6 65.77,31.53 U$4.7 | U$4.8 65.12,31.92 65.25,32.05
  Top 0.813: C7.2 64.94,34.56 | 65.1,33.82 U$11.P$1 | C8.1 65.2,32.86 65.04,32.7
  Top 1.016: 65.7,31.6 65.25,32.05 65.04,32.26 65.04,32.7 U$11.P$1
  Bottom 0.813: B.4 64.87,35.43 v65,35.3
  Bottom 1.5: B.4 64.87,41.47 B.3 65.13,44.01 B.2 64.87,46.55 B.1
BEN
  Top 0.254: U$7.17 30.2,42.45 R5.1
BRAKE  (via drill 0.25)
  Top 0.254: U$2.28 49.33,15.4 BRAKE.1 | U$3.11 25.05,11.15 v25,11.1 | v25,18 v38.3,18 | v38.3,14.3 38.43,14.43 BRAKE.4
  Bottom 0.254: BRAKE.4 42.77,14.43 BRAKE.3 45.31,14.17 BRAKE.2 47.85,14.43 BRAKE.1 | v25,11.1 v25,18 | v38.3,18 v38.3,14.3
C  (via drill 0.25)
  Top 0.254: D5.P$2 65.42,22.52 65.1,22.2 63.9,22.2 63.4,22.7 R22.2 D5.P$3 64.58,24.46 v64.71,24.6 | v67.1,31.7 68.3,31.7 68.85,32.25
  Top 0.406: 63.51,23.07 R22.2 | U$6.6 70.23,31.17 70,31.4
  Top 0.61: 70.13,31.27 70,31.4 69.7,31.7 69.6,31.7 69.5,31.6 69.58,31.52 U$6.7 | U$6.8 68.93,32.03 69,32.1
  Top 0.813: U$12.P$1 68.88,33.86 | C8.2 68.84,34.56 68.9,34.5 68.9,33.81 U$12.P$1 | C.4 68.85,37.8 68.85,37.1 | 68.85,37.1 U$12.P$1 | C9.2 65.85,37.1 68.85,37.1
  Top 1.016: U$12.P$1 68.85,32.25 69,32.1 69.5,31.6
  Bottom 0.254: v64.71,24.6 64.71,28.39 64.5,28.6 64.5,30.4 65.8,31.7 v67.1,31.7
  Bottom 1.5: C.4 67.47,41.47 C.3 67.73,44.01 C.2 67.47,46.55 C.1
CLK  (via drill 0.25)
  Top 0.254: AS5047P.2 53.86,8.44 53.3,9 49.43,9 CLK.1 | U$3.26 37.05,9.15 v37.1,9.1 | v37.1,7.8 40.35,7.8 CLK.4
  Bottom 0.254: CLK.4 42.77,7.93 CLK.3 45.31,7.67 CLK.2 47.85,7.93 CLK.1 | v37.1,9.1 v37.1,7.8
CS
  Top 0.254: AS5047P.1 55.91,9.09 53.3,11.7 49.53,11.7 CS.1 | CS.4 38.35,8.4 36.6,8.4 36.35,8.65 U$3.25
  Bottom 0.254: CS.4 42.77,10.53 CS.3 45.31,10.27 CS.2 47.85,10.53 CS.1
DIR  (via drill 0.25)
  Top 0.254: U$2.26 51.07,16.4 DIR.1 | U$3.12 25.35,10.65 25.3,10.6 25.25,10.55 23.84,10.55 v23.7,10.7 | DIR.4 40.05,19.2 v23.7,19.2
  Bottom 0.254: DIR.4 42.77,19.63 DIR.3 45.31,19.37 DIR.2 47.85,19.63 DIR.1 | v23.7,19.2 v23.7,10.7
EN  (via drill 0.25)
  Top 0.254: U$3.14 24.35,9.65 v24.3,9.6 | v24.3,18.6 39.01,18.6 EN.4 | U$2.27 48.97,15.9 EN.1
  Bottom 0.254: EN.4 42.77,17.03 EN.3 45.31,16.77 EN.2 47.85,17.03 EN.1 | v24.3,9.6 v24.3,18.6
FB
  Top 0.254: R4.2 R3.1 28.05,44.5 U$7.1
GHA  (via drill 0.25, 0.25 pad 0.25)
  Top 0.254: U$5.3 62.61,27.29 v62.7,27.2 | v62.7,19.5 62.9,19.3 U$2.21
  Bottom 0.254: v62.7,27.2 v62.7,19.5
GHB  (via drill 0.25)
  Top 0.254: U$4.3 66.4,27.9 66.4,27.3 v66.5,27.2 | v64.5,17.7 U$2.19
  Bottom 0.254: v66.5,27.2 66.5,20.9 66.8,20.6 66.8,20 v64.5,17.7
GHC
  Top 0.254: U$2.17 65.5,20.7 65.8,21 69.4,21 71.5,23.1 71.5,25.7 70.22,26.98 U$6.3
GLA  (via drill 0.25, 0.25 pad 0.25)
  Top 0.254: U$5.5 63.29,30.9 v64.1,30.9 | U$2.16 66,20.3 v66.1,20.4
  Bottom 0.254: v64.1,30.9 64.1,22.4 v66.1,20.4
GLB  (via drill 0.25, 0.25 pad 0.25)
  Top 0.254: U$4.5 67.1,30.9 67.8,30.9 arc-90 v68,30.8 | U$2.15 v68,19.3
  Bottom 0.254: v68,19.3 68,28.1 67.9,28.2 67.9,30.6 68,30.7 v68,30.8
GLC
  Top 0.254: U$2.14 68.2,18.4 72.2,22.4 72.2,30.3 71.6,30.9 70.9,30.9 U$6.5
GND  (via drill 0.25)
  Top 0.254: SJ1.1 v7.4,27.3 SJ2.1 | SJ3.1 v7.4,22.1 SJ4.1 | J2.5 v4.57,13.1 | C10.2 57.85,31.55 v57.8,31.5 57.8,31.3 R2.1 | U$2.13 66,17.9 v65,16.9 | v65,16.9 65.2,16.7 65.7,16.7 66.5,15.9 U$2.7 66.5,14 69.1,11.4 69.1,10.9 | v65,16.9 U$2.25 61.6,16.9 58.1,20.4 U$9.3 | v53.3,32.5 R25.1 | AS5047P.5 64.41,6.49 66.5,4.4 68.6,4.4 69.1,4.9 69.1,8.5 | 69.1,8.5 69.1,10.9 | AS5047P.13 69.04,8.44 69.1,8.5 | MOTLO.1 48.43,36.4 v53.3,36.4 | v37.7,23.4 37.65,23.45 C17.1 32.7,23.45 R9.2 | v34.9,12.4 49.4,12.4 50.9,13.9 58.9,13.9 59.15,13.65 R20.2 v61.1,13 | MOTLO.4 37.73,36.43 v37.7,36.4 | VSS.4 18.15,44.2 v19.5,44.2 | v19.5,17.5 v23.1,17.5 | v22.2,45.5 22.1,45.4 16.9,45.4 16.7,45.6 14.2,45.6 12.94,44.34 VSS.2 | C14.2 69.1,10.9 | v36.4,44.2 40.55,44.2 VA-.4 | R24.2 v33.8,26
  Top 0.406: VOUT-.P$1 v22.1,31.2
  Top 1.5: R2.1 58.55,30.65 VIN-.P$1 58.55,39 V-.4
  Bottom 0.254: v7.4,27.3 v7.4,22.1 7.4,18.8 | MOTLO.1 47.95,36.43 MOTLO.2 45.41,36.17 MOTLO.3 42.87,36.43 MOTLO.4 | VA-.4 42.87,44.23 VA-.3 45.41,43.97 VA-.2 47.95,44.23 VA-.1 48.27,43.97 50.1,45.8 50.1,48.8 | VSS.1 12.69,44.33 VSS.2 15.23,44.07 VSS.3 17.77,44.33 VSS.4 | v4.57,13.1 4.97,13.5 5,13.5 7.4,15.9 7.4,18.8 | v57.8,31.5 56.8,32.5 v53.3,32.5 v53.3,36.4 | v61.1,13 v65,16.9 | v37.7,23.4 v37.7,36.4 | v19.5,44.2 19.5,19 | 19.5,19 v19.5,17.5 | 7.4,18.8 19.3,18.8 19.5,19 | v33.8,26 33.8,36.7 34.6,37.5 34.6,44.2 v36.4,44.2
  Bottom 0.406: v22.1,31.2 v22.1,36.4 | v33.8,37.7 v33.8,44.2 33.8,48.8 50.1,48.8 56.63,48.8 V-.1
  Bottom 1.5: V-.4 58.37,41.47 V-.3 58.63,44.01 V-.2 58.37,46.55 V-.1
  pour Top (isolate 0.15): 22.1,46.8 35.1,46.8 35.1,35.1 22.1,35.1
  pour Top (isolate 0.15): 22.1,17.6 35.1,17.6 35.1,2.6 22.1,2.6
HA
  Top 0.254: U$2.1 63.5,8.4 66.7,5.2 67.91,5.2 AS5047P.8
HB
  Top 0.254: U$2.3 64.5,8.5 67.16,5.84 AS5047P.9
HC
  Top 0.254: U$2.5 65.5,8.3 67.3,6.5 67.91,6.5 AS5047P.10
I2C_SCL  (via drill 0.25)
  Top 0.254: SJ1.3 10.27,28.6 SCL.1 | U$3.22 29.35,7.45 28.9,7 28.9,6.3 v29.3,5.9 | v29.3,3.6 v22,3.6 | v22,28.6 18.15,28.6 SCL.4
  Bottom 0.254: SCL.1 12.69,28.73 SCL.2 15.23,28.47 SCL.3 17.77,28.73 SCL.4 | v29.3,5.9 v29.3,3.6 | v22,3.6 v22,28.6
I2C_SDA  (via drill 0.25)
  Top 0.254: SJ3.3 10.27,23.4 SDA.1 | SDA.4 18.15,23.4 v20.8,23.4 | v20.8,1.8 v31.2,1.8 | v31.2,13.9 30.35,13.05 U$3.1
  Bottom 0.254: SDA.1 12.69,23.53 SDA.2 15.23,23.27 SDA.3 17.77,23.53 SDA.4 | v20.8,23.4 v20.8,1.8 | v31.2,1.8 v31.2,13.9
LED1  (via drill 0.25)
  Top 0.254: R8.2 10.27,7.8 LED1.1 | v29.5,6.8 29.85,7.15 U$3.23 | v26,7.8 25.4,7.2 18.49,7.2 LED1.4
  Bottom 0.254: LED1.1 12.69,7.93 LED1.2 15.23,7.67 LED1.3 17.77,7.93 LED1.4 | v26,7.8 28.5,7.8 v29.5,6.8
LED3
  Top 0.254: R14.2 10.27,5.2 LED3.1 | U$3.24 30.35,5.95 29.5,5.1 18.05,5.1 LED3.4
  Bottom 0.254: LED3.1 12.69,5.33 LED3.2 15.23,5.07 LED3.3 17.77,5.33 LED3.4
LED4  (via drill 0.25)
  Top 0.254: R15.2 10.27,2.6 LED4.1 | LED4.4 26.77,2.47 v26.8,2.4 | v26.8,6.9 26.85,6.95 U$3.17
  Bottom 0.254: LED4.1 12.69,2.73 LED4.2 15.23,2.47 LED4.3 17.77,2.73 LED4.4 | v26.8,2.4 v26.8,6.9
MISO  (via drill 0.25)
  Top 0.254: MISO.1 49.37,5.07 50.7,6.4 59.7,6.4 61.09,7.79 AS5047P.3 | U$3.28 38.25,10.15 v38.3,10.1 | v38.3,5.2 40.35,5.2 MISO.4
  Bottom 0.254: MISO.4 42.77,5.33 MISO.3 45.31,5.07 MISO.2 47.85,5.33 MISO.1 | v38.3,10.1 v38.3,5.2
MOSI  (via drill 0.25)
  Top 0.254: MOSI.1 49.27,2.47 50.7,3.9 54.7,3.9 54.7,4 55.9,5.2 59.4,5.2 61.34,7.14 AS5047P.4 | U$3.27 37.45,9.65 v37.7,9.4 | v37.7,2.6 40.35,2.6 MOSI.4
  Bottom 0.254: MOSI.4 42.77,2.73 MOSI.3 45.31,2.47 MOSI.2 47.85,2.73 MOSI.1 | v37.7,9.4 v37.7,2.6
MOT_CURRENT  (via drill 0.25)
  Top 0.254: U$8.1 | R7.2 24.75,20.8 U$8.1 | U$3.20 28.35,5.85 v28.4,5.8 | v28.4,2.4 v35.8,2.4 | v35.9,31.2 40.55,31.2 MOTCUR.4 | U$8.1 27.75,20.05 28,19.8 v36.4,19.8 | v36.4,29.7 46.93,29.7 MOTCUR.1
  Bottom 0.254: MOTCUR.4 42.87,31.23 MOTCUR.3 45.41,30.97 MOTCUR.2 47.95,31.23 MOTCUR.1 | v28.4,5.8 v28.4,2.4 | v35.8,2.4 35.8,31.1 v35.9,31.2 | v36.4,19.8 v36.4,29.7
MOTGND  (via drill 0.25)
  Top 0.254: R10.2 32.6,22.15 C17.2 38.25,22.15 v38.3,22.2 | v53.3,26 v51.3,26 | v51.3,33.5 51.23,33.57 MOTHI.1 | v38.3,33.85 40.56,33.85 MOTHI.4
  Top 0.305: 62,29.41 v62,29.4 62,29.6 62.08,29.6
  Top 1.422: 62.26,29.41 U$5.9
  Top 1.5: U$6.9 v69.6,29.4 U$4.9 v65.8,29.4 U$5.9 | R2.2 59,27.8 60.6,29.4 v61.3,29.4
  Bottom 0.254: MOTHI.4 42.87,33.83 MOTHI.3 45.41,33.57 MOTHI.2 47.95,33.83 MOTHI.1 | v38.3,22.2 v38.3,33.85 | v57.9,27.3 56.6,26 v53.3,26 | v51.3,26 v51.3,33.5
  other vias: 62.6,30 62.6,29.4 62.6,28.8 63.3,30 63.3,29.4 63.3,28.8 61.3,30 61.3,28.8 62,30 62,28.8 66.4,30 66.4,29.4 66.4,28.8 67.1,30 67.1,29.4 67.1,28.8 65.1,30 65.1,29.4 65.1,28.8 65.8,30 65.8,28.8 70.2,30 70.2,29.4 70.2,28.8 70.9,30 70.9,29.4 70.9,28.8 68.9,30 68.9,29.4 68.9,28.8 69.6,30 69.6,28.8
  pour Bottom (isolate 0.15): 55.9,20.8 76.7,20.8 76.7,37.7 55.9,37.7
N$1
  Top 0.254: R9.1 31.05,23.4 U$8.4 29.5,23.25 29.5,22.9 29.1,22.5 27.5,22.5 27.4,22.4 25.1,22.4 24.85,22.15 R7.1
N$2
  Top 0.254: U$8.3 31.05,20.8 R19.1 R10.1
N$3
  Top 0.254: D4.P$1 67.67,23.48 67.9,23.7 68.3,23.7 68.5,23.9 68.5,24.4 D4.P$4 69.47,24.43 R18.1
N$4
  Top 0.254: R8.1 D7.C
N$5
  Top 0.254: U$7.18 29.2,42.95 R6.2
N$10
  Top 0.254: R14.1 D11.C
N$12
  Top 0.254: R15.1 D12.C
N$13
  Top 0.2: U$1.4 29.9,31.48
  Top 0.254: 29.9,31.48 R13.1 R16.2
N$14
  Top 0.254: D5.P$1 64.58,23.48 64.8,23.7 65.2,23.7 65.4,23.9 65.4,24.4 D5.P$4 66.38,24.43 R23.1
N$15
  Top 0.254: C12.1 28.1,29.42 28.1,28.8 28.3,28.6 U$1.6 U$1.2 31.5,28.6 31.5,30 32.45,30.95 R17.1
N$16
  Top 0.254: D6.P$1 61.48,23.48 61.7,23.7 62.1,23.7 62.3,23.9 62.3,24.4 D6.P$4 63.27,24.43 R22.1
N$19
  Top 0.254: U$2.12 68.3,17.4 69.95,19.05 C5.1
N$20
  Top 0.254: U$2.9 68.2,15.9 69.35,14.75 C4.1
N$21
  Top 0.254: U$2.10 69,16.4 69.3,16.1 70.15,16.1 C4.2
N$36
  Top 0.254: JP1.6 5.62,21.48 7.1,20 7.6,20 7.8,20.2 SJ4.2
N$37
  Top 0.254: JP1.5 6.55,23.95 6.9,24.3 7.6,24.3 7.8,24.1 SJ3.2
N$38
  Top 0.254: JP1.4 6.35,24.45 7.1,25.2 7.6,25.2 7.8,25.4 SJ2.2
N$39
  Top 0.254: JP1.3 6.25,24.95 6.7,25.4 6.7,29.1 7,29.4 7.7,29.4 7.8,29.3 SJ1.2
RESET  (via drill 0.25)
  Top 0.254: J2.3 3.76,14.36 3,13.6 3,11.3 3.9,10.4 8.97,10.4 RESET.1 | v19.5,11.7 18.15,11.7 RESET.4 | U$3.19 27.85,6.3 R1.1 v27.5,5.9 | v27.4,4.4 v19.5,4.4
  Bottom 0.254: RESET.1 12.69,11.83 RESET.2 15.23,11.57 RESET.3 17.77,11.83 RESET.4 | v19.5,4.4 v19.5,11.7 | v27.5,5.9 27.5,4.5 v27.4,4.4
SWD_CLK  (via drill 0.25)
  Top 0.254: J2.4 10.33,14.36 PCLK.1 | v23.1,14.1 18.09,14.1 PCLK.4 | U$3.10 23.15,11.65 v23.1,11.7
  Bottom 0.254: PCLK.1 12.69,14.43 PCLK.2 15.23,14.17 PCLK.3 17.77,14.43 PCLK.4 | v23.1,11.7 v23.1,14.1
SWD_DIO  (via drill 0.25)
  Top 0.254: J2.2 9,15.63 PDIO.1 | U$3.13 v22.55,10.15 | 18.05,16.8 PDIO.4 18.15,16.9 v22.6,16.9
  Bottom 0.254: PDIO.1 12.69,17.03 PDIO.2 15.23,16.77 PDIO.3 17.77,17.03 PDIO.4 | v22.55,10.15 22.55,16.85 v22.6,16.9
TA  (via drill 0.25, 0.25 pad 0.25)
  Top 0.254: U$5.4 63.26,27.34 v63.4,27.2 | 62.1,22.2 60.8,22.2 60.8,24 61.23,24.43 D6.P$3 61.5,24.45 | 62.1,22.2 62.3,22.4 62.3,22.95 D6.P$2 | v63.4,21.4 63.3,21.3 62.1,21.3 | 62.1,21.3 62.1,22.2 | U$2.22 62.1,18.9 62.1,21.3
  Bottom 0.254: v63.4,27.2 v63.4,21.4
TB  (via drill 0.25)
  Top 0.254: 67,27.9 67.02,27.92 U$4.4 67.07,27.53 v67.4,27.2 | D4.P$3 R23.2 66.5,22.7 | D4.P$2 68.53,22.62 68.1,22.2 67,22.2 66.5,22.7 | 67.7,24.45 D4.P$3 | U$2.20 64,20.4 65.8,22.2 66,22.2 66.5,22.7 | D4.P$3 67.47,24.43 v67.4,24.5
  Bottom 0.254: v67.4,27.2 v67.4,24.5
TC  (via drill 0.25)
  Top 0.254: 70.9,27.92 U$6.4 70.88,27.12 v70.9,27.1 | U$2.18 65,20.8 65.8,21.6 69.2,21.6 v70.9,23.3
  Bottom 0.254: v70.9,23.3 v70.9,27.1
TEMP  (via drill 0.25)
  Top 0.254: U$3.9 26.1,12.9 v25.8,12.9 | v25.8,25.4 39.01,25.4 40.48,23.93 TEMP.4 | TEMP.1 56.32,23.27 U$9.2
  Bottom 0.254: TEMP.4 42.77,23.53 TEMP.3 45.31,23.27 TEMP.2 47.85,23.53 TEMP.1 | v25.8,12.9 v25.8,25.4
UART_RX  (via drill 0.25)
  Top 0.254: SJ2.3 10.27,26 RX.1 | RX.4 21.27,25.87 v21.4,26 | v21.4,3 v32.5,3 | v32.5,11.7 32.45,11.65 U$3.31
  Bottom 0.254: RX.1 12.69,26.13 RX.2 15.23,25.87 RX.3 17.77,26.13 RX.4 | v21.4,26 v21.4,3 | v32.5,3 v32.5,11.7
UART_TX  (via drill 0.25)
  Top 0.254: SJ4.3 10.27,20.8 TX.1 | TX.4 18.15,20.8 v20.1,20.8 | v20.1,1.2 v31.8,1.2 | v31.9,13 31.1,12.2 U$3.32
  Bottom 0.254: TX.1 12.69,20.93 TX.2 15.23,20.67 TX.3 17.77,20.93 TX.4 | v20.1,20.8 v20.1,1.2 | v31.8,1.2 31.9,1.3 v31.9,13
V+  (via drill 0.25)
  Top 0.254: 32.2,41.95 32.15,42 32.25,42.1 R5.2 | U$2.11 68.6,16.9 69.45,17.75 C5.2 v70.2,17.8 | VIN+.P$1 56.15,34.8 C10.1 | v70.2,26 69.1,27.1 | R26.2 55.87,28.12 55.95,28.2
  Top 0.406: U$7.16 30.9,41.95 | C2.1 30.8,41.85 30.9,41.95 | 32.2,41.95 38.85,41.95 v39,42.1 | V+.1 54.13,48.7 39.6,48.7 39,48.1 v39,48 | 30.9,41.95 32.1,41.95 32.15,42
  Top 0.61: U$5.1 61.65,27.65 61.6,27.6 | U$4.1 65.45,27.45 65.4,27.4 | 69.2,27.4 69.25,27.45 U$6.1
  Top 1.27: 61.6,27.6 61.6,26.2 61.4,26 | 65.4,27.4 65.4,26.1 65.3,26 | 69.1,27.1 69.2,27.2 69.2,27.4
  Top 1.5: 69.1,27.1 68,26 65.3,26 61.4,26 57.2,26 55.95,27.25 55.95,28.2 VIN+.P$1 55.95,39 V+.4
  Bottom 0.254: v70.2,26 v70.2,17.8
  Bottom 0.406: v39,42.1 v39,48
  Bottom 1.5: V+.4 55.77,41.47 V+.3 56.03,44.01 V+.2 55.77,46.55 V+.1
V_1.7  (via drill 0.25)
  Top 0.254: U$2.2 64,15.6 64.4,16 v65,16 | v65,16 U$2.4 | U$2.6 66,15.6 65.6,16 v65,16 | R20.1 R21.2 v55.9,11.7
  Bottom 0.254: V1.7.1 51.87,4.89 V1.7.2 | V1.7.2 52.13,7.43 V1.7.3 51.87,9.97 V1.7.4 53.61,11.7 v55.9,11.7 | v65,16 65,15.9 61.5,12.4 60.5,12.4 53.3,5.2 52.19,5.2 V1.7.2
V_3.0  (via drill 0.25)
  Top 0.254: C3.1 26.75,23.4 U$8.5 27.75,23.85 28.8,24.9 36.6,24.9 v37.1,24.4 | R13.2 31.18,30.82 31.2,30.8 31,30.6 C13.1 30.65,30.33 U$1.3 | U$3.7 27.35,14.25 v27.3,14.3 C16.1 | v27.3,34.8 v20.8,34.8 | v20.8,41.6 20.67,41.47 VDDA.4 | R13.2 38.6,31.8 39.3,32.5 42.3,32.5 42.5,32.3 44.9,32.3 45.1,32.5 46.4,32.5 46.9,33 46.9,40.39 V3.0.2 | VDDA.2 14.11,40.3 14.21,40.4 16.3,40.4 16.4,40.3 v22.8,40.3 | R13.2 31.18,32.32 30.5,33 22.9,33 v22.8,33.1
  Bottom 0.254: V3.0.1 47.95,41.63 V3.0.2 45.41,41.37 V3.0.3 42.87,41.63 V3.0.4 40.45,41.5 37.1,41.5 v37.1,24.4 | VDDA.1 12.69,41.73 VDDA.2 15.23,41.47 VDDA.3 17.77,41.73 VDDA.4 | v27.3,14.3 v27.3,34.8 | v20.8,34.8 v20.8,41.6 | v22.8,33.1 v22.8,40.3
V_BATT  (via drill 0.25)
  Top 0.254: U$3.30 38.95,11.15 v39,11.2 | R25.2 R26.1 50.01,29.08 V_BATT.1
  Bottom 0.254: V_BATT.1 47.85,27.43 V_BATT.2 45.31,27.17 V_BATT.3 42.77,27.43 V_BATT.4 39,25.95 v39,11.2

### Text on the board
tPlace: 5V+ | 5V-